# Altium project SmartWatch-V2.PrjPCB
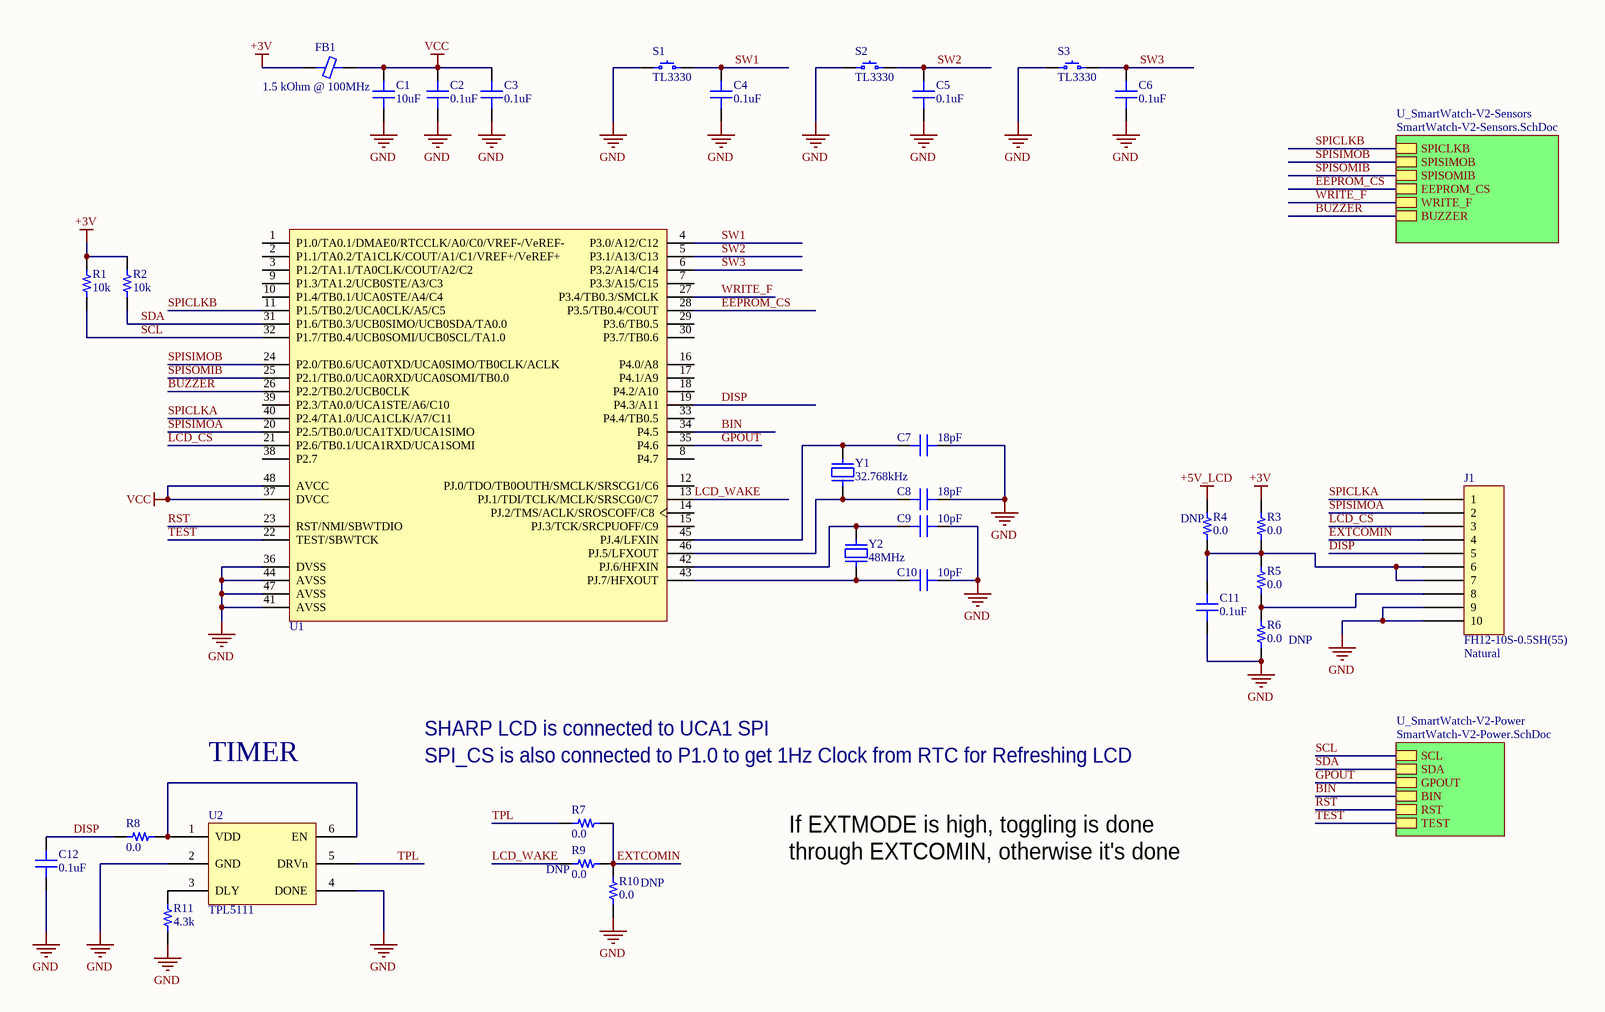
[diagram p0: SmartWatch-V2.SchDoc]
3 sheets, 80 parts. Net scope: hierarchical (ports join the sheet entries above them; power ports are global).
Board file: SmartWatch-V2.PcbDoc
Sheets:
  SmartWatch-V2.SchDoc
    U_SmartWatch-V2-Sensors = SmartWatch-V2-Sensors.SchDoc
    U_SmartWatch-V2-Power = SmartWatch-V2-Power.SchDoc

## Sheet SmartWatch-V2.SchDoc
size A3; DocumentNumber: 1; SheetNumber: 1; SheetTotal: 3

### Parts
C1  10uF  [CAP 0603/1608]
C2  0.1uF  [CAP 0402/1005]
C3  0.1uF  [CAP 0402/1005]
C4  0.1uF  [CAP 0402/1005]
C5  0.1uF  [CAP 0402/1005]
C6  0.1uF  [CAP 0402/1005]
C7  18pF  [CAP 0402/1005]
C8  18pF  [CAP 0402/1005]
C9  10pF  [CAP 0402/1005]
C10  10pF  [CAP 0402/1005]
C11  0.1uF  [CAP 0402/1005]
C12  0.1uF  [CAP 0402/1005]
FB1  1.5 kOhm @ 100MHz  [FER 0603/1608]
J1  FH12-10S-0.5SH(55)  Colour: Natural  [FH12-10S-0.5SH(55)]
R1  10k  [RES 0402/1005]
R2  10k  [RES 0402/1005]
R3  0.0  [RES 0603/1608]
R4  0.0  [RES 0603/1608]
R5  0.0  [RES 0603/1608]
R6  0.0  [RES 0603/1608]
R7  0.0  [RES 0603/1608]
R8  0.0  [RES 0603/1608]
R9  0.0  [RES 0603/1608]
R10  0.0  [RES 0603/1608]
R11  4.3k  [RES 0603/1608]
S1  TL3330  [TL3330]
S2  TL3330  [TL3330]
S3  TL3330  [TL3330]
U1  MSP430FR5969IRGZ  [TI-RGZ48-4100X4100TP_N]  (value not drawn)
U2  TPL5111  [TI SOT-23-6 DDC]
Y1  32.768kHz  [ABRACON ABS07]
Y2  48MHz  [Kyocera CX3225GB]

### Sub-sheets
U_SmartWatch-V2-Power = SmartWatch-V2-Power.SchDoc: SCL, SDA, GPOUT, BIN, RST, TEST
U_SmartWatch-V2-Sensors = SmartWatch-V2-Sensors.SchDoc: SPICLKB, SPISIMOB, SPISOMIB, EEPROM_CS, WRITE_F, BUZZER

### Nets
+3V: FB1.1 R1.2 R2.2 R3.2
+5V_LCD: R4.2
GND: C1.1 C2.1 C3.1 C4.1 C5.1 C6.1 C7.2 C8.2 C9.2 C10.2 C11.1 C12.1 J1.9 J1.10 R6.1 R10.1 R11.1 S1.1 S2.1 S3.1 U1.36(DVSS) U1.41(AVSS) U1.44(AVSS) U1.47(AVSS) U2.2(GND) U2.4(DONE)
VCC: C1.2 C2.2 C3.2 FB1.2 U1.37(DVCC) U1.48(AVCC)
BIN: U1.34(P4.5) ; sheet U_SmartWatch-V2-Power/BIN
BUZZER: U1.26(P2.2/TB0.2/UCB0CLK) ; sheet U_SmartWatch-V2-Sensors/BUZZER
DISP: C12.2 J1.5 R8.2 U1.19(P4.3/A11)
EEPROM_CS: U1.28(P3.5/TB0.4/COUT) ; sheet U_SmartWatch-V2-Sensors/EEPROM_CS
EXTCOMIN: J1.4 R7.1 R9.1 R10.2
GPOUT: U1.35(P4.6) ; sheet U_SmartWatch-V2-Power/GPOUT
LCD_CS: J1.3 U1.21(P2.6/TB0.1/UCA1RXD/UCA1SOMI)
LCD_WAKE: R9.2 U1.13(PJ.1/TDI/TCLK/MCLK/SRSCG0/C7)
RST: U1.23(RST/NMI/SBWTDIO) ; sheet U_SmartWatch-V2-Power/RST
SCL: R1.1 U1.32(P1.7/TB0.4/UCB0SOMI/UCB0SCL/TA1.0) ; sheet U_SmartWatch-V2-Power/SCL
SDA: R2.1 U1.31(P1.6/TB0.3/UCB0SIMO/UCB0SDA/TA0.0) ; sheet U_SmartWatch-V2-Power/SDA
SPICLKA: J1.1 U1.40(P2.4/TA1.0/UCA1CLK/A7/C11)
SPICLKB: U1.11(P1.5/TB0.2/UCA0CLK/A5/C5) ; sheet U_SmartWatch-V2-Sensors/SPICLKB
SPISIMOA: J1.2 U1.20(P2.5/TB0.0/UCA1TXD/UCA1SIMO)
SPISIMOB: U1.24(P2.0/TB0.6/UCA0TXD/UCA0SIMO/TB0CLK/ACLK) ; sheet U_SmartWatch-V2-Sensors/SPISIMOB
SPISOMIB: U1.25(P2.1/TB0.0/UCA0RXD/UCA0SOMI/TB0.0) ; sheet U_SmartWatch-V2-Sensors/SPISOMIB
SW1: C4.2 S1.2 U1.4(P3.0/A12/C12)
SW2: C5.2 S2.2 U1.5(P3.1/A13/C13)
SW3: C6.2 S3.2 U1.6(P3.2/A14/C14)
TEST: U1.22(TEST/SBWTCK) ; sheet U_SmartWatch-V2-Power/TEST
TPL: R7.2 U2.5(DRVn)
WRITE_F: U1.27(P3.4/TB0.3/SMCLK) ; sheet U_SmartWatch-V2-Sensors/WRITE_F
NetC7_1: C7.1 U1.45(PJ.4/LFXIN) Y1.2
NetC8_1: C8.1 U1.46(PJ.5/LFXOUT) Y1.1
NetC9_1: C9.1 U1.42(PJ.6/HFXIN) Y2.3
NetC10_1: C10.1 U1.43(PJ.7/HFXOUT) Y2.1
NetC11_2: C11.2 J1.6 J1.7 R3.1 R4.1 R5.2
NetJ1_8: J1.8 R5.1 R6.2
NetR8_1: R8.1 U2.1(VDD) U2.6(EN)
NetR11_2: R11.2 U2.3(DLY)

Not connected (* = marked no-connect by the designer): U1 1(P1.0/TA0.1/DMAE0/RTCCLK/A0/C0/VREF-/VeREF-) 2(P1.1/TA0.2/TA1CLK/COUT/A1/C1/VREF+/VeREF+) 3(P1.2/TA1.1/TA0CLK/COUT/A2/C2) 7(P3.3/A15/C15) 8(P4.7) 9(P1.3/TA1.2/UCB0STE/A3/C3) 10(P1.4/TB0.1/UCA0STE/A4/C4) 12(PJ.0/TDO/TB0OUTH/SMCLK/SRSCG1/C6) 14(PJ.2/TMS/ACLK/SROSCOFF/C8) 15(PJ.3/TCK/SRCPUOFF/C9) 16(P4.0/A8) 17(P4.1/A9) 18(P4.2/A10) 29(P3.6/TB0.5) 30(P3.7/TB0.6) 33(P4.4/TB0.5) 38(P2.7) 39(P2.3/TA0.0/UCA1STE/A6/C10)

### Notes on the sheet
- (near R4) DNP
- (near R6) DNP
- TIMER
- SHARP LCD is connected to UCA1 SPI
- SPI_CS is also connected to P1.0 to get 1Hz Clock from RTC for Refreshing LCD
- If EXTMODE is high, toggling is done through EXTCOMIN, otherwise it's done through SPI.
- (near R9) DNP
- DNP

### Library data of the parts
C1 = GRM188R60J106ME47D: CAP CER 10UF 6.3V X5R 0603; Manufacturer: Murata Electronics North America; TemperatureRange: -55C ~ 85C; Tolerance: 20%; Value: 10uF; Part Number: GRM188R60J106ME47D; PartId: 12950; Supplier 1: Digi-Key; Supplier Part Number 1: 490-3896-2-ND; ComponentLink1Description: Datasheet; ComponentLink1URL: http://www.murata.com/~/media/webrenewal/support/library/catalog/products/capacitor/mlcc/c02e.pdf; ComponentLink2Description: Digi-Key Listing; ComponentLink2URL: https://www.digikey.com/product-detail/en/murata-electronics-north-america/GRM188R60J106ME47D/490-3896-2-ND/965910; TemperatureCoefficient: X5R; Voltage: 6.3V; Price: 0,031; Device Package: 0603 (1608 Metric)
C2-C6 C11 C12 = C1005X7R1C104K050BC: CAP CER 0.1UF 16V X7R 0402; Manufacturer: TDK Corporation; TemperatureRange: -55C ~ 125C; Tolerance: 10%; Value: 0.1uF; Part Number: C1005X7R1C104K050BC; PartId: 3856; Supplier 1: Digi-Key; Supplier Part Number 1: 445-4952-2-ND; ComponentLink1Description: Datasheet; ComponentLink1URL: https://product.tdk.com/info/en/catalog/datasheets/mlcc_commercial_general_en.pdf; ComponentLink2Description: Digi-Key listing; ComponentLink2URL: http://digikey.com/product-detail/en/C1005X7R1C104K050BC/445-4952-2-ND/2093220; TemperatureCoefficient: X7R; Voltage: 16V; Price: 0,0066; Type: -; Device Package: 0402 (1005 Metric)
C7 C8 = C1005C0G1H180J050BA: CAP CER 18PF 50V C0G 0402; Manufacturer: TDK Corporation; TemperatureRange: -55C ~ 125C; TemperatureCoefficient: C0G, NP0; Tolerance: 5%; Value: 18pF; Part Number: C1005C0G1H180J050BA; PartId: 3882; Supplier 1: Digi-Key; Supplier Part Number 1: 445-1238-2-ND; ComponentLink1Description: Datasheet; ComponentLink1URL: https://product.tdk.com/info/en/catalog/datasheets/mlcc_commercial_general_en.pdf; ComponentLink2Description: Digi-Key listing; ComponentLink2URL: http://digikey.com/product-detail/en/C1005C0G1H180J050BA/445-1238-2-ND/513675; Voltage: 50V; Price: 0,006; Type: -; Device Package: 0402 (1005 Metric)
C9 C10 = C1005C0G1H100D050BA: CAP CER 10PF 50V C0G 0402; Manufacturer: TDK Corporation; TemperatureRange: -55C ~ 125C; TemperatureCoefficient: C0G, NP0; Tolerance: 0.5pF; Value: 10pF; Part Number: C1005C0G1H100D050BA; PartId: 3878; Supplier 1: Digi-Key; Supplier Part Number 1: 445-1235-2-ND; ComponentLink1Description: Datasheet; ComponentLink1URL: https://product.tdk.com/info/en/catalog/datasheets/mlcc_commercial_general_en.pdf; ComponentLink2Description: Digi-Key listing; ComponentLink2URL: http://digikey.com/product-detail/en/C1005C0G1H100D050BA/445-1235-2-ND/513663; Voltage: 50V; Price: 0,006; Type: -; Device Package: 0402 (1005 Metric)
FB1 = BLM18HE152SN1D: FERRITE CHIP 1500 OHM 500MA 0603; Manufacturer: Murata Electronics North America; Type: Differential Mode - Single; DC Resistance: 500 mOhm Max; Part Number: BLM18HE152SN1D; PartId: 6736; Value: 1.5 kOhm @ 100MHz; Supplier 1: Digi-Key; Supplier Part Number 1: 490-5216-2-ND; ComponentLink1Description: Datasheet; ComponentLink1URL: http://search.murata.co.jp/Ceramy/image/img/PDF/ENG/L0110S0101BLM18H.pdf; ComponentLink2Description: Digi-Key listing; ComponentLink2URL: http://digikey.com/product-detail/en/BLM18HE152SN1D/490-5216-2-ND/1948321; Price: 0,0833; Device Package: 0603 (1608 Metric); Current Rating: 500mA
J1 = FH12-10S-0.5SH(55): CONN FFC BOTTOM 10POS 0.50MM R/A; Part Number: FH12-10S-0.5SH(55); PartId: 16458
R1 R2 = ERA-2AED103X: RES SMD 10K OHM 0.5% 1/16W 0402; Manufacturer: Panasonic Electronic Components; TemperatureRange: -55C ~ 155C; TemperatureCoefficient: 25ppm/C; PowerRating: 0.063W, 1/16W; Value: 10k; Part Number: ERA-2AED103X; PartId: 540; Supplier 1: Digi-Key; Supplier Part Number 1: P10KDETR-ND; ComponentLink1Description: Datasheet; ComponentLink1URL: http://industrial.panasonic.com/lecs/www-data/pdf/AOA0000/AOA0000CE26.pdf; ComponentLink2Description: Digikey listing; ComponentLink2URL: http://digikey.com/product-detail/en/ERA-2AED103X/P10KDETR-ND/1706126; Tolerance: 0.5%; Price: 0,0353; Type: Thin Film; Device Package: 0402 (1005 Metric)
R3-R5 R7 R8 = ERJ-3GEY0R00V: RES SMD 0.0OHM JUMPER 1/10W 0603; Manufacturer: Panasonic Electronic Components; TemperatureRange: -55C ~ 155C; PowerRating: 0.1W, 1/10W; Value: 0.0; Part Number: ERJ-3GEY0R00V; PartId: 16111; Supplier 1: Digi-Key; Supplier Part Number 1: P0.0GTR-ND; ComponentLink1Description: Datasheet; ComponentLink1URL: http://industrial.panasonic.com/www-cgi/jvcr13pz.cgi?E+PZ+3+AOA0001+ERJ3GEY0R00V+7+WW; ComponentLink2Description: Digi-Key Listing; ComponentLink2URL: https://www.digikey.com/product-detail/en/panasonic-electronic-components/ERJ-3GEY0R00V/P0.0GTR-ND/135656; Tolerance: Jumper; Price: 0,0031; Device Package: 0603 (1608 Metric)
R6 R9 R10 = ERJ-3GEY0R00V: DNP; Manufacturer: Panasonic Electronic Components; TemperatureRange: -55C ~ 155C; Tolerance: Jumper; PowerRating: 0.1W, 1/10W; Value: 0.0; Part Number: ERJ-3GEY0R00V; PartId: 16111; Supplier 1: Digi-Key; Supplier Part Number 1: P0.0GTR-ND; ComponentLink1Description: Datasheet; ComponentLink1URL: http://industrial.panasonic.com/www-cgi/jvcr13pz.cgi?E+PZ+3+AOA0001+ERJ3GEY0R00V+7+WW; ComponentLink2Description: Digi-Key Listing; ComponentLink2URL: https://www.digikey.com/product-detail/en/panasonic-electronic-components/ERJ-3GEY0R00V/P0.0GTR-ND/135656; Price: 0,0031; Device Package: 0603 (1608 Metric)
R11 = ERA-3AEB432V: RES SMD 4.3K OHM 0.1% 1/10W 0603; Manufacturer: Panasonic Electronic Components; TemperatureRange: -55C ~ 155C; TemperatureCoefficient: 25ppm/C; PowerRating: 0.1W, 1/10W; Value: 4.3k; Part Number: ERA-3AEB432V; PartId: 1536; Supplier 1: Digi-Key; Supplier Part Number 1: P4.3KDBTR-ND; ComponentLink1Description: Datasheet; ComponentLink1URL: http://industrial.panasonic.com/lecs/www-data/pdf/AOA0000/AOA0000CE26.pdf; ComponentLink2Description: Digi-Key listing; ComponentLink2URL: http://digikey.com/product-detail/en/ERA-3AEB432V/P4.3KDBTR-ND/1465869; Tolerance: 0.1%; Price: 0,055; Type: Thin Film; Device Package: 0603 (1608 Metric)
S1-S3 = TL3330: SWITCH TACTILE SPST-NO 0.02A 15V; Manufacturer: E-Switch; Part Number: TL3330; PartId: 16469
U1 = MSP430FR5969IRGZ: 16BIT 64KB FRAM 48VQFN; Manufacturer: Texas Instruments; PartNumber: MSP430FR5969RGZ; ADC: 10-bit SAR; ADC Channels: 14; Brown Out Reset: Yes; DMA: 3; Eco-Plan: Green (RoHS & no Sb/Br); FRAM(KB): 16; GPIO: 33; Multiplier: 32x32; SRAM(B): 1024; SubFamily: FRAM Series; Timers - 16-bit: 5; USCI_A (UART/LIN/IrDA/SPI): 2; USCI_B (I2C & SPI): 1; DatasheetVersion: SLAS639D; PackageReference: RHA40-2900X2900TP; PackageDescription: 48-Pin Plastic Flat Pack, Body 7 x 7 mm, Pitch 0.5 mm; Supplier 1: Digi-Key; Supplier Part Number 1: 296-29235-2-ND; Supplier 2: Digi-Key; Supplier Part Number 2: 296-29235-1-ND; Supplier 3: Digi-Key; Supplier Part Number 3: 296-29235-6-ND; Supplier 4: Newark; Supplier Part Number 4: 45T9762; Supplier 5: Mouser; Supplier Part Number 5: 595-MSP430FR5739IDAR; Comparators: Yes; Frequency(MHz): 16; Real-Time Clock: Yes; SVS: Yes; Watchdog: Yes; Mounting Technology: Surface Mount; Code_JEDEC: MO-153; ComponentLink1Description: Manufacturer URL; ComponentLink1URL: http://www.ti.com/; ComponentLink2Description: Datasheet; ComponentLink2URL: http://www.ti.com/general/docs/lit/getliterature.tsp?genericPartNumber=MSP430FR5739&fileType=pdf; ComponentLink3Description: Package Specification; ComponentLink3URL: http://www.ti.com/litv/pdf/mtss003d; Part Number: MSP430FR5969IRGZ; PartId: 1
Y1 = ABS07-120-32.768KHZ-T: CRYSTAL 32.7680KHZ 6PF SMD; Manufacturer: Abracon LLC; Frequency Tolerance: 20ppm; ESR: 55 kOhm; Operating Mode: Fundamental; Part Number: ABS07-120-32.768KHZ-T; PartId: 8490; Supplier 1: Digi-Key; Supplier Part Number 1: 535-11937-2-ND; ComponentLink1Description: Datasheet; ComponentLink1URL: http://www.abracon.com/Resonators/ABS07-120-32.768kHz-T.pdf; ComponentLink2Description: Digi-Key Listing; ComponentLink2URL: http://www.digikey.com/product-detail/en/ABS07-120-32.768KHZ-T/535-11937-2-ND/3724043; Price: 0,3784; Type: kHz Crystal (Tuning Fork); Device Package: 2-SMD; Frequency: 32.768kHz; Frequency Stability: -; Load Capacitance: 6pF
Y2 = CX3225GB48000D0HPQCC: CRYSTAL 48.0000MHZ 8PF SMD; Manufacturer: AVX Corp/Kyocera Corp; Frequency Stability: 30ppm; Frequency Tolerance: 20ppm; ESR: 50 Ohm; Operating Mode: Fundamental; Part Number: CX3225GB48000D0HPQCC; PartId: 8842; Supplier 1: Digi-Key; Supplier Part Number 1: 1253-1226-2-ND; ComponentLink1Description: Datasheet; ComponentLink1URL: http://media.digikey.com/pdf/Data%20Sheets/AVX%20PDFs/CX3225GBxD0HPQCC_Series_Spec.pdf; ComponentLink2Description: Digi-Key Listing; ComponentLink2URL: https://www.digikey.com/product-detail/en/CX3225GB48000D0HPQCC/1253-1226-2-ND/4453903; Price: 0,3915; Type: MHz Crystal; Device Package: 4-SMD, No Lead (DFN, LCC); Series: CX3225GB, Kyocera; Frequency: 48MHz; Load Capacitance: 8pF

## Sheet SmartWatch-V2-Sensors.SchDoc
size A4; DocumentNumber: 2; SheetNumber: 2; SheetTotal: 3
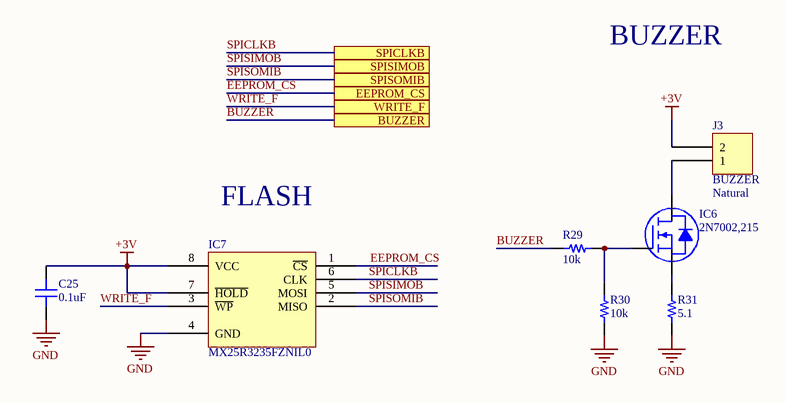
[diagram p1: SmartWatch-V2-Sensors.SchDoc]

### Parts
C25  0.1uF  [CAP 0402/1005]
IC6  2N7002,215  [NXP SOT-23-3 TO-236AB]
IC7  MX25R3235FZNIL0  [SPANSION WSON-8 6x5MM]
J3  BUZZER  Colour: Natural  [ST-025BH]
R29  10k  [RES 0402/1005]
R30  10k  [RES 0603/1608]
R31  5.1  [RES 0603/1608]

### Ports
BUZZER, EEPROM_CS, SPICLKB, SPISIMOB, SPISOMIB, WRITE_F

### Nets
+3V: C25.2 IC7.7(~{HOLD}) IC7.8(VCC) J3.2
GND: C25.1 IC7.4(GND) R30.1 R31.1
BUZZER: R29.2 ; port BUZZER
EEPROM_CS: IC7.1(~{CS}) ; port EEPROM_CS
SPICLKB: IC7.6(CLK) ; port SPICLKB
SPISIMOB: IC7.5(MOSI) ; port SPISIMOB
SPISOMIB: IC7.2(MISO) ; port SPISOMIB
WRITE_F: IC7.3(~{WP}) ; port WRITE_F
NetIC6_1: IC6.1(G) R29.1 R30.2
NetIC6_2: IC6.2(D) J3.1
NetIC6_3: IC6.3(S) R31.2

### Notes on the sheet
- BUZZER
- (near IC7) FLASH

### Library data of the parts
C25 = C1005X7R1C104K050BC: as C2 on sheet SmartWatch-V2; Value: 0.1uF; Part Number: C1005X7R1C104K050BC; PartId: 3856; Supplier 1: Digi-Key; Supplier Part Number 1: 445-4952-2-ND; ComponentLink1Description: Datasheet; ComponentLink1URL: https://product.tdk.com/info/en/catalog/datasheets/mlcc_commercial_general_en.pdf; ComponentLink2Description: Digi-Key listing; ComponentLink2URL: http://digikey.com/product-detail/en/C1005X7R1C104K050BC/445-4952-2-ND/2093220; TemperatureCoefficient: X7R; Voltage: 16V; Price: 0,0066; Type: -; Device Package: 0402 (1005 Metric)
IC6 = 2N7002,215: MOSFET N-CH 60V 300MA SOT-23; Manufacturer: NXP Semiconductors; Rds On (Max) at Id, Vgs: 5 Ohm @ 500mA, 10V; Vgs(th) (Max) at Id: 2.5V @ 250uA; Input Capacitance (Ciss) at Vds: 50pF @ 10V; Power - Max: 830mW; Current Continuous Drain: 300mA (Ta); Part Number: 2N7002,215; PartId: 7965; Supplier 1: Digi-Key; Supplier Part Number 1: 568-1369-2-ND; ComponentLink1Description: Datasheet; ComponentLink1URL: http://www.nxp.com/documents/data_sheet/2N7002.pdf; ComponentLink2Description: Digi-Key Listing; ComponentLink2URL: http://www.digikey.com/product-detail/en/2N7002,215/568-1369-2-ND/762973; Price: 0,0368; Type: MOSFET N-Channel, Metal Oxide; Device Package: TO-236-3, SC-59, SOT-23-3; Gate Charge (Qg): -; Drain to Source Voltage (Vdss): 60V; Features: Logic Level Gate
IC7 = S25FL116K0XNFI011: IC FLASH MEM 16MB SPI CMOS 8WSON; Manufacturer: Spansion; Memory Type: FLASH - NOR; Memory Size: 16M (2M x 8); Speed: 108MHz; Interface: SPI Serial; Voltage - Supply: 2.7 V ~ 3.6 V; Part Number: S25FL116K0XNFI011; PartId: 8258; Supplier 1: Digi-Key; Supplier Part Number 1: 1274-1131-ND; ComponentLink1Description: Datasheet; ComponentLink1URL: http://www.spansion.com/Support/Datasheets/S25FL1-K_00.pdf; ComponentLink2Description: Digi-Key Listing; ComponentLink2URL: http://www.digikey.com/product-detail/en/S25FL116K0XNFI011/1274-1131-ND/4517162; Price: 0,49; Type: FLASH - NOR; Device Package: 8-WDFN Exposed Pad; Operating Temperature: -40C ~ 85C
J3 = B2B-XH-A(LF)(SN): CONN HEADER XH TOP 2POS 2.5MM; Manufacturer: JST Sales America Inc.; Pitch: 0.098" (2.50mm); Number Of Positions: 2; Part Number: B2B-XH-A(LF)(SN); PartId: 16449; Supplier 1: Digi-Key; Supplier Part Number 1: 455-2247-ND; ComponentLink1Description: Datasheet; ComponentLink1URL: http://www.jst-mfg.com/product/pdf/eng/eXH.pdf; ComponentLink2Description: Digi-Key Listing; ComponentLink2URL: http://www.digikey.com/product-detail/en/jst-sales-america-inc/B2B-XH-A(LF)(SN)/455-2247-ND/1651045; Price: 0,15; Type: Header, Shrouded; Contact Finish: Tin; Fastening Type: Detent Lock; Number Of Rows: 1; Series: XH
R29 = ERA-2AED103X: as R1 on sheet SmartWatch-V2; Value: 10k; Part Number: ERA-2AED103X; PartId: 540; Supplier 1: Digi-Key; Supplier Part Number 1: P10KDETR-ND; ComponentLink1Description: Datasheet; ComponentLink1URL: http://industrial.panasonic.com/lecs/www-data/pdf/AOA0000/AOA0000CE26.pdf; ComponentLink2Description: Digikey listing; ComponentLink2URL: http://digikey.com/product-detail/en/ERA-2AED103X/P10KDETR-ND/1706126; Tolerance: 0.5%; Price: 0,0353; Type: Thin Film; Device Package: 0402 (1005 Metric)
R30 = ERA-3AEB103V: RES SMD 10K OHM 0.1% 1/10W 0603; Manufacturer: Panasonic Electronic Components; TemperatureRange: -55C ~ 155C; TemperatureCoefficient: 25ppm/C; PowerRating: 0.1W, 1/10W; Value: 10k; Part Number: ERA-3AEB103V; PartId: 1432; Supplier 1: Digi-Key; Supplier Part Number 1: P10KDBTR-ND; ComponentLink1Description: Datasheet; ComponentLink1URL: http://industrial.panasonic.com/lecs/www-data/pdf/AOA0000/AOA0000CE26.pdf; ComponentLink2Description: Digi-Key listing; ComponentLink2URL: http://digikey.com/product-detail/en/ERA-3AEB103V/P10KDBTR-ND/1465878; Tolerance: 0.1%; Price: 0,055; Type: Thin Film; Device Package: 0603 (1608 Metric)
R31 = ERJ-3GEYJ5R1V: RES SMD 5.1 OHM 5% 1/10W 0603; Manufacturer: Panasonic Electronic Components; TemperatureRange: -55C ~ 155C; TemperatureCoefficient: -100/ +600ppm/C; PowerRating: 0.1W, 1/10W; Value: 5.1; Part Number: ERJ-3GEYJ5R1V; PartId: 11240; Supplier 1: Digi-Key; Supplier Part Number 1: P5.1GTR-ND; ComponentLink1Description: Datasheet; ComponentLink1URL: http://industrial.panasonic.com/www-cgi/jvcr13pz.cgi?E+PZ+3+AOA0001+ERJ3GEYJ5R1V+7+WW; ComponentLink2Description: Digi-Key Listing; ComponentLink2URL: https://www.digikey.com/product-detail/en/panasonic-electronic-components/ERJ-3GEYJ5R1V/P5.1GTR-ND/282128; Tolerance: 5%; Price: 0,002; Device Package: 0603 (1608 Metric)

## Sheet SmartWatch-V2-Power.SchDoc
size A4; DocumentNumber: 3; SheetNumber: 3; SheetTotal: 3
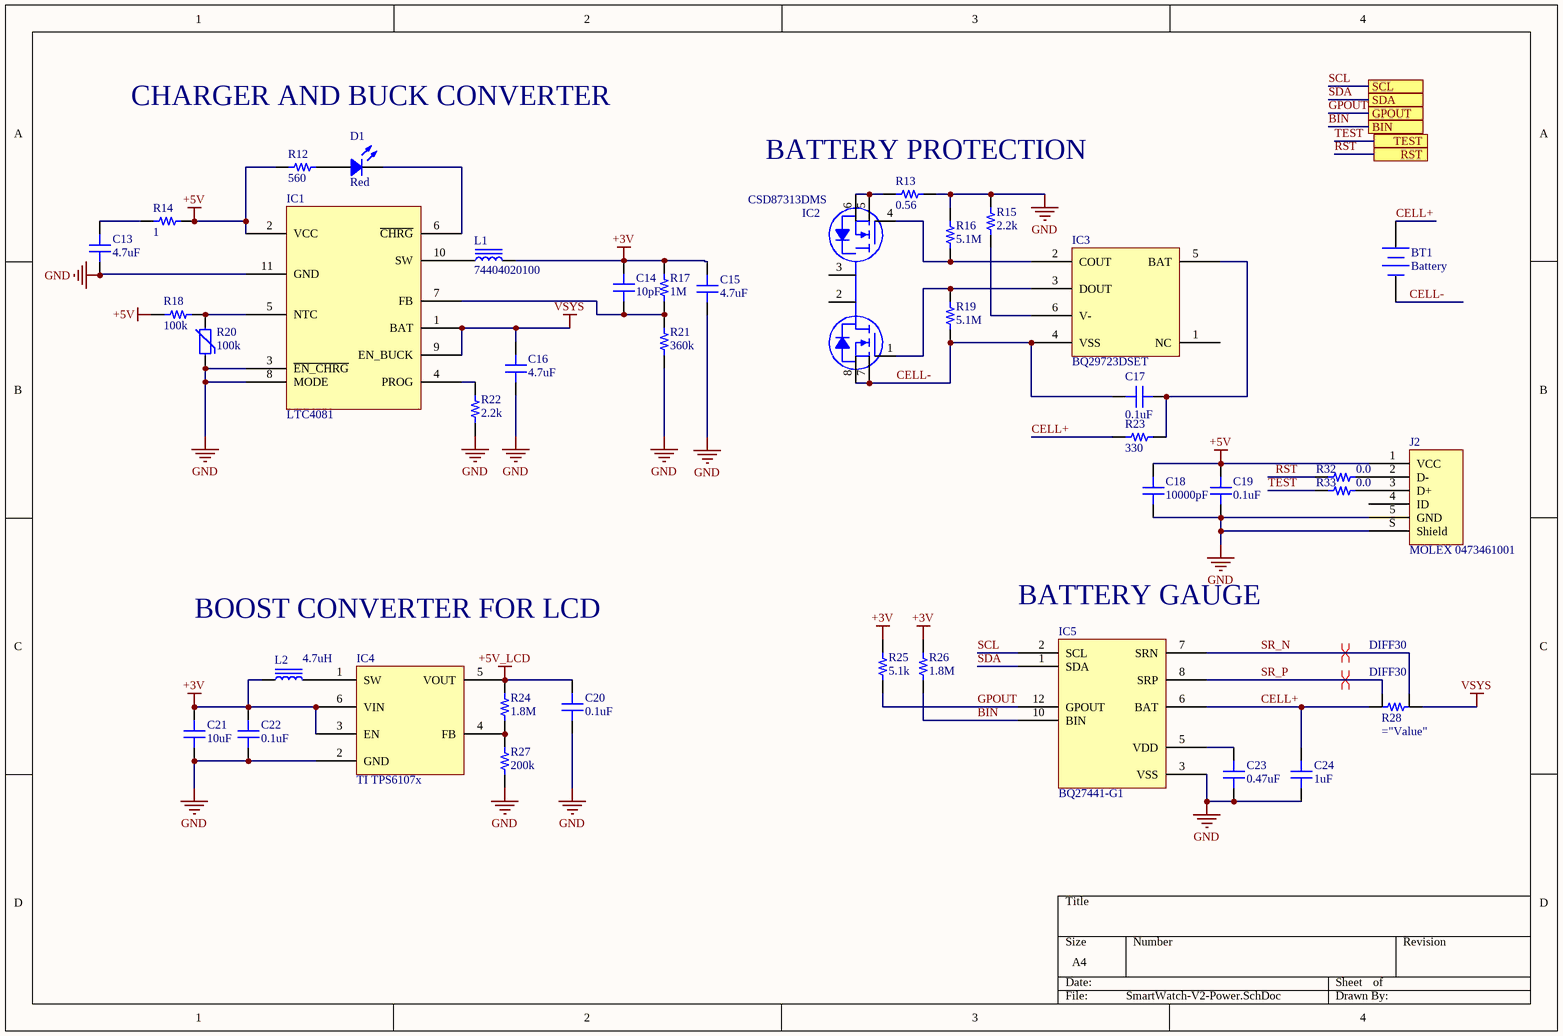
[diagram p2: SmartWatch-V2-Power.SchDoc]

### Parts
BT1  Battery  [BAT-2]
C13  4.7uF  [CAP 0402/1005]
C14  10pF  [CAP 0402/1005]
C15  4.7uF  [CAP 0402/1005]
C16  4.7uF  [CAP 0402/1005]
C17  0.1uF  [CAP 0402/1005]
C18  10000pF  [CAP 0603/1608]
C19  0.1uF  [CAP 0402/1005]
C20  0.1uF  [CAP 0402/1005]
C21  10uF  [CAP 0402/1005]
C22  0.1uF  [CAP 0402/1005]
C23  0.47uF  [CAP 0402/1005]
C24  1uF  [CAP 0402/1005]
D1  Red  [LED 0603/1608 RED]
IC1  LTC4081  [LT DFN-10 3mmx3mm DD]
IC2  CSD87313DMS  [TI WSON-8 3.3x3.3mm]
IC3  BQ29723DSET  [TI WSON-6]
IC4  TI TPS6107x  [TI SOT-23-6 DDC]
IC5  BQ27441-G1  [TI VSON-12 2.5x4mm]
J2  MOLEX 0473461001  [MOLEX 0473461001]
L1  74404020100  [TDK VLS201612CX]
L2  4.7uH  [TDK VLS201612CX]
R12  560  [RES 0402/1005]
R13  0.56  [RES 0603/1608]
R14  1  [RES 0402/1005]
R15  2.2k  [RES 0402/1005]
R16  5.1M  [RES 0402/1005]
R17  1M  [RES 0402/1005]
R18  100k  [RES 0402/1005]
R19  5.1M  [RES 0402/1005]
R20  Resistance in Ohms @ 25C: 100k  [FER 0603/1608]
R21  360k  [RES 0402/1005]
R22  2.2k  [RES 0402/1005]
R23  330  [RES 0402/1005]
R24  1.8M  [RES 0603/1608]
R25  5.1k  [RES 0402/1005]
R26  1.8M  [RES 0402/1005]
R27  200k  [RES 0603/1608]
R28  (no value)  [Current Res CSR1206]  (net tie, no BOM)
R32  0.0  [RES 0603/1608]
R33  0.0  [RES 0603/1608]

### Ports
BIN, GPOUT, RST, SCL, SDA, TEST

### Nets
+3V: C14.2 C15.2 C21.2 C22.2 IC4.3(EN) IC4.6(VIN) L1.2 L2.1 R17.2 R25.2 R26.2
+5V: C18.2 C19.2 IC1.2(VCC) J2.1(VCC) R12.1 R14.2 R18.1
+5V_LCD: C20.2 IC4.5(VOUT) R24.2
GND: C13.1 C15.1 C16.1 C18.1 C19.1 C20.1 C21.1 C22.1 C23.1 C24.1 IC1.3(~{EN_CHRG}) IC1.8(MODE) IC1.11(GND) IC4.2(GND) IC5.3(VSS) J2.5(GND) J2.S(Shield) R13.2 R15.2 R16.2 R20.1 R21.1 R22.1 R27.1
VSYS: C16.2 IC1.1(BAT) IC1.9(EN_BUCK) R28.2
BIN: IC5.10(BIN) R26.1 ; port BIN
CELL+: BT1.1(+) C24.2 IC5.6(BAT) R23.1 R28.1
CELL-: BT1.2(-) C17.1 IC2.7(S1) IC2.8(S2) IC3.4(VSS) R19.1
GPOUT: IC5.12(GPOUT) R25.1 ; port GPOUT
RST: R32.2 ; port RST
SCL: IC5.2(SCL) ; port SCL
SDA: IC5.1(SDA) ; port SDA
SR_N: IC5.7(SRN) R28.4
SR_P: IC5.8(SRP) R28.3
TEST: R33.2 ; port TEST
NetC13_2: C13.2 R14.1
NetC14_1: C14.1 IC1.7(FB) R17.1 R21.2
NetC17_2: C17.2 IC3.5(BAT) R23.2
NetC23_2: C23.2 IC5.5(VDD)
NetD1_1: D1.1 R12.2
NetD1_2: D1.2 IC1.6(~{CHRG})
NetIC1_4: IC1.4(PROG) R22.2
NetIC1_5: IC1.5(NTC) R18.2 R20.2
NetIC1_10: IC1.10(SW) L1.1
NetIC2_1: IC2.1(G1) IC3.3(DOUT) R19.2
NetIC2_4: IC2.4(G2) IC3.2(COUT) R16.1
NetIC2_5: IC2.5(S2) IC2.6(S3) R13.1
NetIC3_6: IC3.6(V-) R15.1
NetIC4_1: IC4.1(SW) L2.2
NetIC4_4: IC4.4(FB) R24.1 R27.2
NetJ2_2: J2.2(D-) R32.1
NetJ2_3: J2.3(D+) R33.1

Not connected (* = marked no-connect by the designer): IC2 2(D) 3(D); IC3 1(NC); IC5 4(NC) 9(NC) 11(NC); J2 4(ID)

### Layout directives
differential pair; net class DIFF30: SR_N, SR_P

### Notes on the sheet
- CHARGER AND BUCK CONVERTER
- BATTERY PROTECTION
- BOOST CONVERTER FOR LCD
- (near IC5) BATTERY GAUGE

### Library data of the parts
BT1 = Battery: Multicell Battery; Published: 24-Mar-1999; LatestRevisionDate: 17-Jul-2002; LatestRevisionNote: Re-released for DXP Platform.; PackageReference: BAT-2; Publisher: Altium Limited; PackageDescription: Battery; 2 Leads
C13 C15 C16 = CC0402MRX5R4BB475: CAP CER 4.7UF 4V X5R 0402; Manufacturer: Yageo; TemperatureRange: -55C ~ 85C; Tolerance: 20%; Value: 4.7uF; Part Number: CC0402MRX5R4BB475; PartId: 12625; Supplier 1: Digi-Key; Supplier Part Number 1: 311-1728-2-ND; ComponentLink1Description: Datasheet; ComponentLink1URL: http://www.yageo.com/documents/recent/UPY-GPHC_X5R_4V-to-50V-21.pdf; ComponentLink2Description: Digi-Key Listing; ComponentLink2URL: https://www.digikey.com/product-detail/en/yageo/CC0402MRX5R4BB475/311-1728-2-ND/5195137; TemperatureCoefficient: X5R; Voltage: 4V; Price: 0,034; Device Package: 0402 (1005 Metric)
C14 = C1005C0G1H100D050BA: as C9 on sheet SmartWatch-V2; Value: 10pF; Part Number: C1005C0G1H100D050BA; PartId: 3878; Supplier 1: Digi-Key; Supplier Part Number 1: 445-1235-2-ND; ComponentLink1Description: Datasheet; ComponentLink1URL: https://product.tdk.com/info/en/catalog/datasheets/mlcc_commercial_general_en.pdf; ComponentLink2Description: Digi-Key listing; ComponentLink2URL: http://digikey.com/product-detail/en/C1005C0G1H100D050BA/445-1235-2-ND/513663; Voltage: 50V; Price: 0,006; Type: -; Device Package: 0402 (1005 Metric)
C17 C19 C20 C22 = C1005X7R1E104K050BB: CAP CER 0.1UF 25V X7R 0402; Manufacturer: TDK Corporation; TemperatureRange: -55C ~ 125C; Tolerance: 10%; Value: 0.1uF; Part Number: C1005X7R1E104K050BB; PartId: 3858; Supplier 1: Digi-Key; Supplier Part Number 1: 445-7348-2-ND; ComponentLink1Description: Datasheet; ComponentLink1URL: https://product.tdk.com/info/en/catalog/datasheets/mlcc_commercial_general_en.pdf; ComponentLink2Description: Digi-Key listing; ComponentLink2URL: http://digikey.com/product-detail/en/C1005X7R1E104K050BB/445-7348-2-ND/2732783; TemperatureCoefficient: X7R; Voltage: 25V; Price: 0,0211; Type: -; Device Package: 0402 (1005 Metric)
C18 = C1608X7R2A103K080AA: CAP CER 10000PF 100V X7R 0603; Manufacturer: TDK Corporation; TemperatureRange: -55C ~ 125C; Tolerance: 10%; Value: 10000pF; Part Number: C1608X7R2A103K080AA; PartId: 4033; Supplier 1: Digi-Key; Supplier Part Number 1: 445-1304-1-ND; ComponentLink1Description: Datasheet; ComponentLink1URL: https://product.tdk.com/info/en/catalog/datasheets/mlcc_commercial_midvoltage_en.pdf; ComponentLink2Description: Digi-Key listing; ComponentLink2URL: http://digikey.com/product-detail/en/C1608X7R2A103K080AA/445-1304-1-ND/567706; TemperatureCoefficient: X7R; Voltage: 100V; Price: 0,14; Type: -; Device Package: 0603 (1608 Metric)
C21 = C1005X5R0J106M050BC: CAP CER 10UF 6.3V X5R 0402; Manufacturer: TDK Corporation; TemperatureRange: -55C ~ 85C; Tolerance: 20%; Value: 10uF; Part Number: C1005X5R0J106M050BC; PartId: 12380; Supplier 1: Digi-Key; Supplier Part Number 1: 445-8920-2-ND; ComponentLink1Description: Datasheet; ComponentLink1URL: https://product.tdk.com/info/en/catalog/datasheets/mlcc_commercial_general_en.pdf; ComponentLink2Description: Digi-Key Listing; ComponentLink2URL: https://www.digikey.com/product-detail/en/tdk-corporation/C1005X5R0J106M050BC/445-8920-2-ND/3507809; TemperatureCoefficient: X5R; Voltage: 6.3V; Price: 0,119; Device Package: 0402 (1005 Metric)
C23 = GRM155R61A474KE15D: CAP CER 0.47UF 10V X5R 0402; Manufacturer: Murata Electronics North America; TemperatureRange: -55C ~ 85C; Tolerance: 10%; Value: 0.47uF; Part Number: GRM155R61A474KE15D; PartId: 12351; Supplier 1: Digi-Key; Supplier Part Number 1: 490-3264-2-ND; ComponentLink1Description: Datasheet; ComponentLink1URL: http://www.murata.com/~/media/webrenewal/support/library/catalog/products/capacitor/mlcc/c02e.pdf; ComponentLink2Description: Digi-Key Listing; ComponentLink2URL: https://www.digikey.com/product-detail/en/murata-electronics-north-america/GRM155R61A474KE15D/490-3264-2-ND/702528; TemperatureCoefficient: X5R; Voltage: 10V; Price: 0,0121; Device Package: 0402 (1005 Metric)
C24 = GRM155R70G105KA12D: CAP CER 1UF 4V X7R 0402; Manufacturer: Murata Electronics North America; TemperatureRange: -55C ~ 125C; Tolerance: 10%; Value: 1uF; Part Number: GRM155R70G105KA12D; PartId: 5154; Supplier 1: Digi-Key; Supplier Part Number 1: 490-7195-2-ND; ComponentLink1Description: Datasheet; ComponentLink1URL: http://www.murata.com/~/media/webrenewal/support/library/catalog/products/capacitor/mlcc/c02e.ashx; ComponentLink2Description: Digi-Key listing; ComponentLink2URL: http://digikey.com/product-detail/en/GRM155R70G105KA12D/490-7195-2-ND/3900466; TemperatureCoefficient: X7R; Voltage: 4V; Price: 0,019; Type: -; Device Package: 0402 (1005 Metric)
D1 = 5975112407F: LED RED DIFFUSED 0603 SMD; Manufacturer: Dialight; Value: Green; Type: Surface Mount; Millicandela: 11.7mcd; Voltage Forward: 1.7V; Current (Test): 20mA; Viewing Angle: 152; Part Number: 5975112407F; PartId: 7057; Supplier 1: Digi-Key; Supplier Part Number 1: 350-2436-2-ND; ComponentLink1Description: Datasheet; ComponentLink1URL: http://www.dialight.com/Assets/Drawings/2D_Drawings_DrawingDetailedSpec/C16413.pdf; ComponentLink2Description: Digi-Key Listing; ComponentLink2URL: http://www.digikey.ca/product-detail/en/5975112407F/350-2436-2-ND/2432587; Price: 0,3092; Device Package: 0603 (1608 Metric); Colour: Red; Lens Transparency: Diffused
IC1 = LTC4081: IC BATTA CHRGR LI-ON with BUCK 10 DFN; Manufacturer: Linear Technology; Part Number: LTC4081; PartId: 16438
IC2 = CSD87313DMS: MOSFET 2 N-CHANNEL 30V 8WSON; Manufacturer: Texas Instruments; Part Number: CSD87313DMS; PartId: 9696
IC3 = BQ29723DSET: IC LITHIUM BATT PROTECT 6WSON; Manufacturer: Texas Instruments; Part Number: BQ29723DSET; PartId: 16440
IC4 = TI TPS6107x: IC REG BOOST ADJ 455MA SYNC SOT6; Manufacturer: Texas Instruments; Part Number: TI TPS6107x; PartId: 16770
IC5 = BQ27441-G1: IC BATT FUEL GAUGE LI-ION 12SON; Manufacturer: Texas Instruments; Part Number: BQ27441-G1; PartId: 16439
J2 = MOLEX 0473461001: CONN USB B SINGLE SMT HORIZ CONNECTOR; Part Number: MOLEX 0473461001; PartId: 9700; Manufacturer: Molex
L1 = VLS201610CX-100M: Manufacturer: TDK Corporation; Value: 10uH; Type: Wirewound; Tolerance: 20%; Current Rating: 710mA; Shielding: Shielded; DC Resistance (DCR): 732 mOhm Max; Part Number: VLS201610CX-100M; PartId: 9403; Supplier 1: Digi-Key; Supplier Part Number 1: 445-172946-2-ND; ComponentLink1Description: Datasheet; ComponentLink1URL: https://product.tdk.com/info/en/catalog/datasheets/inductor_commercial_power_vls201610cx_en.pdf; ComponentLink2Description: Digi-Key Listing; ComponentLink2URL: https://www.digikey.com/product-detail/en/VLS201610CX-100M/445-172946-2-ND/5169751; Price: 0,1549; Device Package: Nonstandard; Series: VLS-CX; Inductance: 10uH; Q @ Freq: -; Frequency - Self Resonant: -; Operating Temperature: -40C ~ 105C
L2 = VLS201612CX-4R7M: FIXED IND 4.7UH 1.12A 252 MOHM; Manufacturer: TDK Corporation; Type: Wirewound; Tolerance: 20%; Shielding: Shielded; DC Resistance (DCR): 252 mOhm Max; Value: 4.7uH; Part Number: VLS201612CX-4R7M; PartId: 9400; Supplier 1: Digi-Key; Supplier Part Number 1: 445-172965-2-ND; ComponentLink1Description: Datasheet; ComponentLink1URL: https://product.tdk.com/info/en/catalog/datasheets/inductor_commercial_power_vls201612cx_en.pdf; ComponentLink2Description: Digi-Key Listing; ComponentLink2URL: https://www.digikey.com/product-detail/en/VLS201612CX-4R7M/445-172965-2-ND/5169770; Price: 0,1549; Device Package: Nonstandard; Series: VLS-CX; Inductance: 4.7uH; Current Rating: 1.12A; Q @ Freq: -; Frequency - Self Resonant: -; Operating Temperature: -40C ~ 105C
R12 = ERA-2APB561X: RES SMD 560 OHM 0.1% 1/16W 0402; Manufacturer: Panasonic Electronic Components; TemperatureRange: -55C ~ 155C; TemperatureCoefficient: 15ppm/C; PowerRating: 0.063W, 1/16W; Value: 560; Part Number: ERA-2APB561X; PartId: 854; Supplier 1: Digi-Key; Supplier Part Number 1: P560CNTR-ND; ComponentLink1Description: Datasheet; ComponentLink1URL: http://industrial.panasonic.com/lecs/www-data/pdf/AOA0000/AOA0000CE26.pdf; ComponentLink2Description: Digikey listing; ComponentLink2URL: http://digikey.com/product-detail/en/ERA-2APB561X/P560CNTR-ND/5140842; Tolerance: 0.1%; Price: 0,3284; Type: Thin Film; Device Package: 0402 (1005 Metric)
R13 = ERJ-3BQJR56V: RES SMD 0.56 OHM 5% 1/4W 0603; Manufacturer: Panasonic Electronic Components; TemperatureRange: -55C ~ 125C; TemperatureCoefficient: 200ppm/C; PowerRating: 0.25W, 1/4W; Value: 0.56; Part Number: ERJ-3BQJR56V; PartId: 11383; Supplier 1: Digi-Key; Supplier Part Number 1: P17441TR-ND; ComponentLink1Description: Datasheet; ComponentLink1URL: https://industrial.panasonic.com/content/data/CC/PDF/news2014/en/AOA0000CE3.pdf; ComponentLink2Description: Digi-Key Listing; ComponentLink2URL: https://www.digikey.com/product-detail/en/panasonic-electronic-components/ERJ-3BQJR56V/P17441TR-ND/5647474; Tolerance: 5%; Price: 0,0301; Device Package: 0603 (1608 Metric)
R14 = RC0402JR-071RL: RES SMD 1 OHM 5% 1/16W 0402; Manufacturer: Yageo; TemperatureRange: -55C ~ 155C; TemperatureCoefficient: 200ppm/C; PowerRating: 0.063W, 1/16W; Value: 1; Part Number: RC0402JR-071RL; PartId: 14504; Supplier 1: Digi-Key; Supplier Part Number 1: 311-1.0JRTR-ND; ComponentLink1Description: Datasheet; ComponentLink1URL: http://www.yageo.com/documents/recent/PYu-RC_Group_51_RoHS_L_04.pdf; ComponentLink2Description: Digi-Key Listing; ComponentLink2URL: https://www.digikey.com/product-detail/en/yageo/RC0402JR-071RL/311-1.0JRTR-ND/726407; Tolerance: 5%; Price: 0,0017; Device Package: 0402 (1005 Metric)
R15 R22 = ERA-2AEB222X: RES SMD 2.2K OHM 0.1% 1/16W 0402; Manufacturer: Panasonic Electronic Components; TemperatureRange: -55C ~ 155C; TemperatureCoefficient: 25ppm/C; PowerRating: 0.063W, 1/16W; Value: 2.2k; Part Number: ERA-2AEB222X; PartId: 671; Supplier 1: Digi-Key; Supplier Part Number 1: P2.2KDCTR-ND; ComponentLink1Description: Datasheet; ComponentLink1URL: http://industrial.panasonic.com/lecs/www-data/pdf/AOA0000/AOA0000CE26.pdf; ComponentLink2Description: Digikey listing; ComponentLink2URL: http://digikey.com/product-detail/en/ERA-2AEB222X/P2.2KDCTR-ND/1706013; Tolerance: 0.1%; Price: 0,0871; Type: Thin Film; Device Package: 0402 (1005 Metric)
R16 R19 = ERJ-2GEJ515X: RES SMD 5.1M OHM 5% 1/10W 0402; Manufacturer: Panasonic Electronic Components; TemperatureRange: -55C ~ 155C; TemperatureCoefficient: -400/ +150ppm/C; PowerRating: 0.1W, 1/10W; Value: 5.1M; Part Number: ERJ-2GEJ515X; PartId: 11092; Supplier 1: Digi-Key; Supplier Part Number 1: P5.1MJTR-ND; ComponentLink1Description: Datasheet; ComponentLink1URL: http://industrial.panasonic.com/www-cgi/jvcr13pz.cgi?E+PZ+3+AOA0001+ERJ2GEJ515X+7+WW; ComponentLink2Description: Digi-Key Listing; ComponentLink2URL: https://www.digikey.com/product-detail/en/panasonic-electronic-components/ERJ-2GEJ515X/P5.1MJTR-ND/282103; Tolerance: 5%; Price: 0,0019; Device Package: 0402 (1005 Metric)
R17 = ERJ-2GEJ105X: RES SMD 1M OHM 5% 1/10W 0402; Manufacturer: Panasonic Electronic Components; TemperatureRange: -55C ~ 155C; TemperatureCoefficient: 200ppm/C; PowerRating: 0.1W, 1/10W; Value: 1M; Part Number: ERJ-2GEJ105X; PartId: 10989; Supplier 1: Digi-Key; Supplier Part Number 1: P1.0MJTR-ND; ComponentLink1Description: Datasheet; ComponentLink1URL: http://industrial.panasonic.com/www-cgi/jvcr13pz.cgi?E+PZ+3+AOA0001+ERJ2GEJ105X+7+WW; ComponentLink2Description: Digi-Key Listing; ComponentLink2URL: https://www.digikey.com/product-detail/en/panasonic-electronic-components/ERJ-2GEJ105X/P1.0MJTR-ND/146900; Tolerance: 5%; Price: 0,0019; Device Package: 0402 (1005 Metric)
R18 = ERA-2AED104X: RES SMD 100K OHM 0.5% 1/16W 0402; Manufacturer: Panasonic Electronic Components; TemperatureRange: -55C ~ 155C; TemperatureCoefficient: 25ppm/C; PowerRating: 0.063W, 1/16W; Value: 100k; Part Number: ERA-2AED104X; PartId: 592; Supplier 1: Digi-Key; Supplier Part Number 1: P100KDETR-ND; ComponentLink1Description: Datasheet; ComponentLink1URL: http://industrial.panasonic.com/lecs/www-data/pdf/AOA0000/AOA0000CE26.pdf; ComponentLink2Description: Digikey listing; ComponentLink2URL: http://digikey.com/product-detail/en/ERA-2AED104X/P100KDETR-ND/1706150; Tolerance: 0.5%; Price: 0,0353; Type: Thin Film; Device Package: 0402 (1005 Metric)
R20 = ABNTC-0603-104J-4250F-T: THERMISTOR NTC 100K OHM 5% 0603; Manufacturer: Abracon LLC; TemperatureRange: -55C ~ 125C; B Value Tolerance: 1%; B25/50: 4250K; Power - Max: 100mW; Value: 100k; Part Number: ABNTC-0603-104J-4250F-T; PartId: 16646; Supplier 1: Digi-Key; Supplier Part Number 1: 535-12851-2-ND; ComponentLink1Description: Datasheet; ComponentLink1URL: http://www.abracon.com/Magnetics/inductors/ABNTC-0603.pdf; ComponentLink2Description: Digi-Key Listing; ComponentLink2URL: https://www.digikey.com/product-detail/en/abracon-llc/ABNTC-0603-104J-4250F-T/535-12851-2-ND/4245602; Price: 0,0799; Resistance Tolerance: 5%; Device Package: 0603 (1608 Metric)
R21 = ERJ-2GEJ364X: RES SMD 360K OHM 5% 1/10W 0402; Manufacturer: Panasonic Electronic Components; TemperatureRange: -55C ~ 155C; TemperatureCoefficient: 200ppm/C; PowerRating: 0.1W, 1/10W; Value: 360k; Part Number: ERJ-2GEJ364X; PartId: 11116; Supplier 1: Digi-Key; Supplier Part Number 1: P360KJTR-ND; ComponentLink1Description: Datasheet; ComponentLink1URL: http://industrial.panasonic.com/www-cgi/jvcr13pz.cgi?E+PZ+3+AOA0001+ERJ2GEJ364X+7+WW; ComponentLink2Description: Digi-Key Listing; ComponentLink2URL: https://www.digikey.com/product-detail/en/panasonic-electronic-components/ERJ-2GEJ364X/P360KJTR-ND/146986; Tolerance: 5%; Price: 0,0019; Device Package: 0402 (1005 Metric)
R23 = ERA-2AED331X: RES SMD 330 OHM 0.5% 1/16W 0402; Manufacturer: Panasonic Electronic Components; TemperatureRange: -55C ~ 155C; TemperatureCoefficient: 25ppm/C; PowerRating: 0.063W, 1/16W; Value: 330; Part Number: ERA-2AED331X; PartId: 598; Supplier 1: Digi-Key; Supplier Part Number 1: P330DETR-ND; ComponentLink1Description: Datasheet; ComponentLink1URL: http://industrial.panasonic.com/lecs/www-data/pdf/AOA0000/AOA0000CE26.pdf; ComponentLink2Description: Digikey listing; ComponentLink2URL: http://digikey.com/product-detail/en/ERA-2AED331X/P330DETR-ND/1706090; Tolerance: 0.5%; Price: 0,0353; Type: Thin Film; Device Package: 0402 (1005 Metric)
R24 = ERJ-3GEYJ185V: RES SMD 1.8M OHM 5% 1/10W 0603; Manufacturer: Panasonic Electronic Components; TemperatureRange: -55C ~ 155C; TemperatureCoefficient: -400/ +150ppm/C; PowerRating: 0.1W, 1/10W; Value: 1.8M; Part Number: ERJ-3GEYJ185V; PartId: 11415; Supplier 1: Digi-Key; Supplier Part Number 1: P1.8MGTR-ND; ComponentLink1Description: Datasheet; ComponentLink1URL: http://industrial.panasonic.com/www-cgi/jvcr13pz.cgi?E+PZ+3+AOA0001+ERJ3GEYJ185V+7+WW; ComponentLink2Description: Digi-Key Listing; ComponentLink2URL: https://www.digikey.com/product-detail/en/panasonic-electronic-components/ERJ-3GEYJ185V/P1.8MGTR-ND/104353; Tolerance: 5%; Price: 0,002; Device Package: 0603 (1608 Metric)
R25 = ERA-2AED512X: RES SMD 5.1K OHM 0.5% 1/16W 0402; Manufacturer: Panasonic Electronic Components; TemperatureRange: -55C ~ 155C; TemperatureCoefficient: 25ppm/C; PowerRating: 0.063W, 1/16W; Value: 5.1k; Part Number: ERA-2AED512X; PartId: 780; Supplier 1: Digi-Key; Supplier Part Number 1: P5.1KDETR-ND; ComponentLink1Description: Datasheet; ComponentLink1URL: http://industrial.panasonic.com/lecs/www-data/pdf/AOA0000/AOA0000CE26.pdf; ComponentLink2Description: Digikey listing; ComponentLink2URL: http://digikey.com/product-detail/en/ERA-2AED512X/P5.1KDETR-ND/1706119; Tolerance: 0.5%; Price: 0,0353; Type: Thin Film; Device Package: 0402 (1005 Metric)
R26 = ERJ-2GEJ185X: RES SMD 1.8M OHM 5% 1/10W 0402; Manufacturer: Panasonic Electronic Components; TemperatureRange: -55C ~ 155C; TemperatureCoefficient: -400/ +150ppm/C; PowerRating: 0.1W, 1/10W; Value: 1.8M; Part Number: ERJ-2GEJ185X; PartId: 11115; Supplier 1: Digi-Key; Supplier Part Number 1: P1.8MJTR-ND; ComponentLink1Description: Datasheet; ComponentLink1URL: http://industrial.panasonic.com/www-cgi/jvcr13pz.cgi?E+PZ+3+AOA0001+ERJ2GEJ185X+7+WW; ComponentLink2Description: Digi-Key Listing; ComponentLink2URL: https://www.digikey.com/product-detail/en/panasonic-electronic-components/ERJ-2GEJ185X/P1.8MJTR-ND/146924; Tolerance: 5%; Price: 0,0019; Device Package: 0402 (1005 Metric)
R27 = ERA-3AEB204V: RES SMD 200K OHM 0.1% 1/10W 0603; Manufacturer: Panasonic Electronic Components; TemperatureRange: -55C ~ 155C; TemperatureCoefficient: 25ppm/C; PowerRating: 0.1W, 1/10W; Value: 200k; Part Number: ERA-3AEB204V; PartId: 1470; Supplier 1: Digi-Key; Supplier Part Number 1: P200KDBTR-ND; ComponentLink1Description: Datasheet; ComponentLink1URL: http://industrial.panasonic.com/lecs/www-data/pdf/AOA0000/AOA0000CE26.pdf; ComponentLink2Description: Digi-Key listing; ComponentLink2URL: http://digikey.com/product-detail/en/ERA-3AEB204V/P200KDBTR-ND/1465909; Tolerance: 0.1%; Price: 0,0653; Type: Thin Film; Device Package: 0603 (1608 Metric)
R28 = Current Resistor: 1206; Part Number: Current Resistor; PartId: 10239
R32 R33 = ERJ-3GEY0R00V: as R3 on sheet SmartWatch-V2; Value: 0.0; Part Number: ERJ-3GEY0R00V; PartId: 16111; Supplier 1: Digi-Key; Supplier Part Number 1: P0.0GTR-ND; ComponentLink1Description: Datasheet; ComponentLink1URL: http://industrial.panasonic.com/www-cgi/jvcr13pz.cgi?E+PZ+3+AOA0001+ERJ3GEY0R00V+7+WW; ComponentLink2Description: Digi-Key Listing; ComponentLink2URL: https://www.digikey.com/product-detail/en/panasonic-electronic-components/ERJ-3GEY0R00V/P0.0GTR-ND/135656; Tolerance: Jumper; Price: 0,0031; Device Package: 0603 (1608 Metric)

## Nets that join several sheets
+3V: SmartWatch-V2 (FB1.1 R1.2 R2.2 R3.2), SmartWatch-V2-Sensors (C25.2 IC7.7 IC7.8 J3.2), SmartWatch-V2-Power (11 pins)
+5V_LCD: SmartWatch-V2 (R4.2), SmartWatch-V2-Power (C20.2 IC4.5 R24.2)
GND: SmartWatch-V2 (26 pins), SmartWatch-V2-Sensors (C25.1 IC7.4 R30.1 R31.1), SmartWatch-V2-Power (24 pins)
BIN: SmartWatch-V2 (U1.34), SmartWatch-V2-Power (IC5.10 R26.1)
BUZZER: SmartWatch-V2 (U1.26), SmartWatch-V2-Sensors (R29.2)
EEPROM_CS: SmartWatch-V2 (U1.28), SmartWatch-V2-Sensors (IC7.1)
GPOUT: SmartWatch-V2 (U1.35), SmartWatch-V2-Power (IC5.12 R25.1)
RST: SmartWatch-V2 (U1.23), SmartWatch-V2-Power (R32.2)
SCL: SmartWatch-V2 (R1.1 U1.32), SmartWatch-V2-Power (IC5.2)
SDA: SmartWatch-V2 (R2.1 U1.31), SmartWatch-V2-Power (IC5.1)
SPICLKB: SmartWatch-V2 (U1.11), SmartWatch-V2-Sensors (IC7.6)
SPISIMOB: SmartWatch-V2 (U1.24), SmartWatch-V2-Sensors (IC7.5)
SPISOMIB: SmartWatch-V2 (U1.25), SmartWatch-V2-Sensors (IC7.2)
TEST: SmartWatch-V2 (U1.22), SmartWatch-V2-Power (R33.2)
WRITE_F: SmartWatch-V2 (U1.27), SmartWatch-V2-Sensors (IC7.3)